# EAGLE schematic brk (EAGLE 6.4)
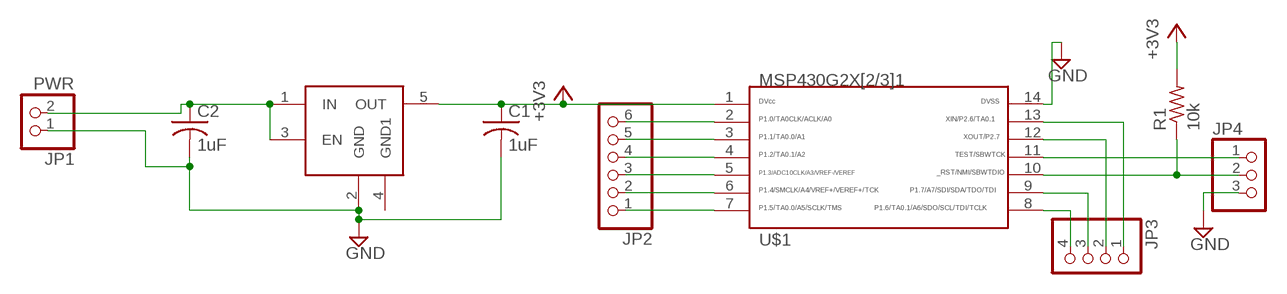
[diagram p0: schematic, sheet 1]

## Parts
C1  1uF  C-USC0805K  [C0805K]
C2  1uF  C-USC0805K  [C0805K]
JP1  PWR  PINHD-1X2  [1X02]
JP2  PINHD-1X6  [1X06]
JP3  PINHD-1X4  [1X04]
JP4  PINHD-1X3  [1X03]
R1  10k  R-US_M0805  [M0805]
U$1  G2X[2/3]1---PW14  [PW14]
U$2  TPS783XX  [DBV-R-PDSO-G5]

## Nets
+3V3: C1.1 R1.2 U$1.1
GND: C1.2 C2.2 JP1.1 JP4.3 U$1.14 U$2.2(GND)
N$1: C2.1 JP1.2 U$2.1(IN) U$2.3(EN)
N$2: JP3.4 U$1.8
N$3: JP3.3 U$1.9
N$4: JP3.2 U$1.12
N$5: JP3.1 U$1.13
N$6: JP2.6 U$1.2
N$7: JP2.5 U$1.3
N$8: JP2.4 U$1.4
N$9: JP2.3 U$1.5
N$10: JP2.2 U$1.6
N$11: JP2.1 U$1.7
N$15: JP4.1 U$1.11
N$16: JP4.2 R1.1 U$1.10
Unconnected: U$2.4(GND1) U$2.5(OUT)

## Library data of the parts
C1 C2 = resistor:C-US: CAPACITOR, American symbol
JP1 = pinhead:PINHD-1X2: PIN HEADER
JP2 = pinhead:PINHD-1X6: PIN HEADER
JP3 = pinhead:PINHD-1X4: PIN HEADER
JP4 = pinhead:PINHD-1X3: PIN HEADER
R1 = resistor:R-US_: RESISTOR, American symbol
U$1 = TI_MSP430_v16:G2X[2/3]1---PW14: MSP430G2X[2/3]1 TSSOP (PW) 14 Pin Package http://focus.ti.com/docs/prod/folders/print/msp430g2221.html MSP430G2121, MSP430G2221, MSP430G2131
U$2 = RobThePyro:TPS783XX